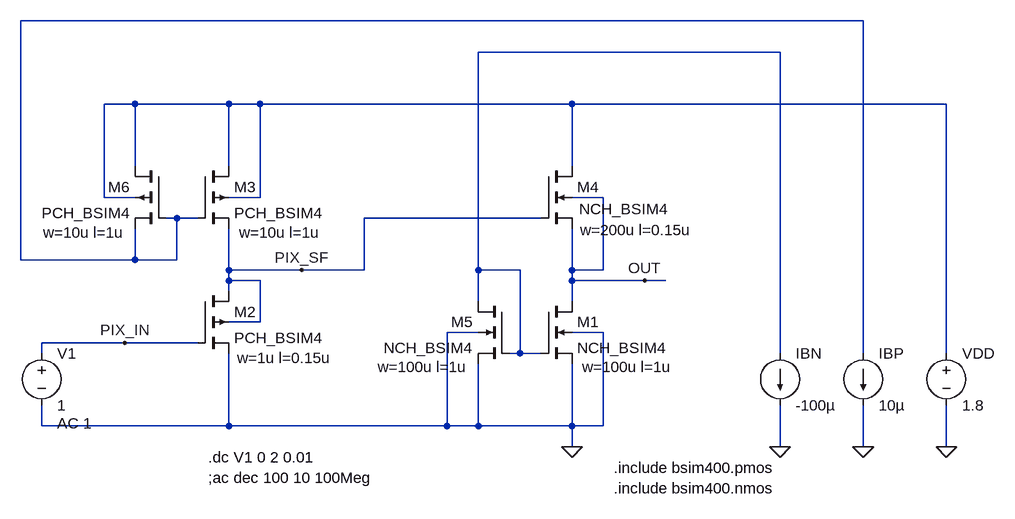
[diagram p0: schematic pixel source follower.asc]
pixel source follower.asc, the LTspice schematic file:
Version 4
SHEET 1 880 680
WIRE 640 -336 -656 -336
WIRE 512 -288 48 -288
WIRE -480 -208 -528 -208
WIRE -336 -208 -480 -208
WIRE -288 -208 -336 -208
WIRE 192 -208 -288 -208
WIRE 768 -208 192 -208
WIRE -480 -112 -480 -208
WIRE -336 -112 -336 -208
WIRE 192 -112 192 -208
WIRE -528 -64 -528 -208
WIRE -480 -64 -528 -64
WIRE -288 -64 -288 -208
WIRE -288 -64 -336 -64
WIRE 240 -64 192 -64
WIRE -416 -32 -432 -32
WIRE -384 -32 -416 -32
WIRE 144 -32 -128 -32
WIRE -656 32 -656 -336
WIRE -480 32 -480 -16
WIRE -480 32 -656 32
WIRE -416 32 -416 -32
WIRE -416 32 -480 32
WIRE -336 48 -336 -16
WIRE -224 48 -336 48
WIRE -128 48 -128 -32
WIRE -128 48 -224 48
WIRE 48 48 48 -288
WIRE 112 48 48 48
WIRE 192 48 192 -16
WIRE 240 48 240 -64
WIRE 240 48 192 48
WIRE -336 64 -336 48
WIRE -288 64 -336 64
WIRE 192 64 192 48
WIRE 304 64 192 64
WIRE 336 64 304 64
WIRE -336 80 -336 64
WIRE 48 96 48 48
WIRE 192 96 192 64
WIRE -288 128 -288 64
WIRE -288 128 -336 128
WIRE 48 144 0 144
WIRE 240 144 192 144
WIRE -496 160 -624 160
WIRE -384 160 -496 160
WIRE -624 176 -624 160
WIRE 112 176 112 48
WIRE 112 176 96 176
WIRE 144 176 112 176
WIRE 512 176 512 -288
WIRE 640 176 640 -336
WIRE 768 176 768 -208
WIRE -624 288 -624 256
WIRE -336 288 -336 176
WIRE -336 288 -624 288
WIRE 0 288 0 144
WIRE 0 288 -336 288
WIRE 48 288 48 192
WIRE 48 288 0 288
WIRE 192 288 192 192
WIRE 192 288 48 288
WIRE 240 288 240 144
WIRE 240 288 192 288
WIRE 192 320 192 288
WIRE 512 320 512 256
WIRE 640 320 640 256
WIRE 768 320 768 256
FLAG 192 320 0
FLAG 768 320 0
FLAG 512 320 0
FLAG 640 320 0
FLAG -496 160 PIX_IN
FLAG 304 64 OUT
FLAG -224 48 PIX_SF
SYMBOL nmos4 144 96 R0
WINDOW 123 64 101 Left 2
SYMATTR InstName M1
SYMATTR Value NCH_BSIM4
SYMATTR Value2 w=100u l=1u
SYMBOL voltage -624 160 R0
WINDOW 123 24 124 Left 2
WINDOW 39 0 0 Left 0
SYMATTR InstName V1
SYMATTR Value 1
SYMATTR Value2 AC 1
SYMBOL pmos4 -384 80 R0
WINDOW 123 61 103 Left 2
SYMATTR InstName M2
SYMATTR Value PCH_BSIM4
SYMATTR Value2 w=1u l=0.15u
SYMBOL pmos4 -384 -112 R0
WINDOW 123 64 102 Left 2
SYMATTR InstName M3
SYMATTR Value PCH_BSIM4
SYMATTR Value2 w=10u l=1u
SYMBOL nmos4 144 -112 R0
WINDOW 3 59 66 Left 2
WINDOW 123 61 98 Left 2
SYMATTR InstName M4
SYMATTR Value NCH_BSIM4
SYMATTR Value2 w=200u l=0.15u
SYMBOL voltage 768 160 R0
WINDOW 123 0 0 Left 0
WINDOW 39 0 0 Left 0
SYMATTR InstName VDD
SYMATTR Value 1.8
SYMBOL nmos4 96 96 M0
WINDOW 123 64 101 Left 2
SYMATTR InstName M5
SYMATTR Value NCH_BSIM4
SYMATTR Value2 w=100u l=1u
SYMBOL pmos4 -432 -112 M0
WINDOW 123 64 102 Left 2
SYMATTR InstName M6
SYMATTR Value PCH_BSIM4
SYMATTR Value2 w=10u l=1u
SYMBOL current 512 176 R0
SYMATTR InstName IBN
SYMATTR Value -100µ
SYMBOL current 640 176 R0
SYMATTR InstName IBP
SYMATTR Value 10µ
TEXT 256 352 Left 2 !.include bsim400.pmos
TEXT 256 384 Left 2 !.include bsim400.nmos
TEXT -368 336 Left 2 !.dc V1 0 2 0.01
TEXT -368 368 Left 2 !;ac dec 100 10 100Meg

The netlist it stands for:
* pixel source follower.asc
M1 OUT N002 0 0 NCH_BSIM4 w=100u l=1u
V1 PIX_IN 0 1 AC 1
M2 PIX_SF PIX_IN 0 PIX_SF PCH_BSIM4 w=1u l=0.15u
M3 N003 N001 PIX_SF N003 PCH_BSIM4 w=10u l=1u
M4 N003 PIX_SF OUT OUT NCH_BSIM4 w=200u l=0.15u
VDD N003 0 1.8
M5 N002 N002 0 0 NCH_BSIM4 w=100u l=1u
M6 N003 N001 N001 N003 PCH_BSIM4 w=10u l=1u
IBN N002 0 -100µ
IBP N001 0 10µ
.model NMOS NMOS
.model PMOS PMOS
.lib standard.mos
.include bsim400.pmos
.include bsim400.nmos
.dc V1 0 2 0.01
;ac dec 100 10 100Meg
.backanno
.end